# Altium schematic sheet Sensor.SchDoc
size A4; SheetNumber: 4; SheetTotal: 4
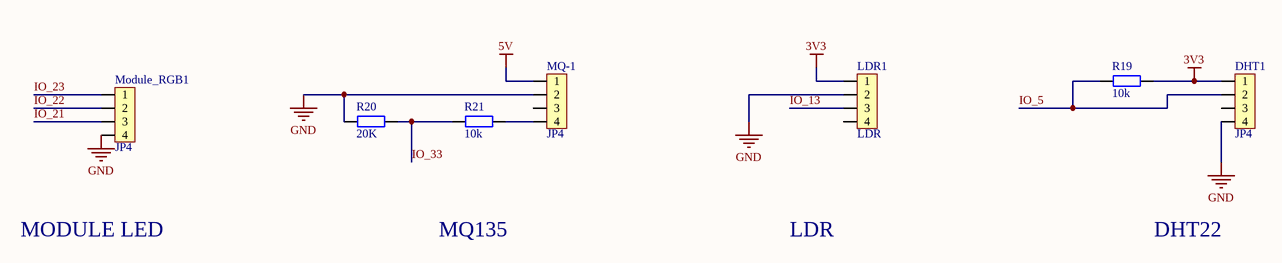
[diagram p0: Sensor.SchDoc]

## Parts
DHT1  JP4  [JP4-C1T]
LDR1  LDR  [JP4-C1T]
Module_RGB1  JP4  [JP4-C1T]
MQ-1  JP4  [JP4-C1T]
R19  10k  [RES-SMD-0805]
R20  20K  [RES-SMD-0805]
R21  10k  [RES-SMD-0805]

## Nets
3V3: DHT1.1 LDR1.1 R19.1
5V: MQ-1.1
GND: DHT1.4 LDR1.2 Module_RGB1.4 MQ-1.2 R20.1
IO_5: DHT1.2 R19.2
IO_13: LDR1.3
IO_21: Module_RGB1.3
IO_22: Module_RGB1.2
IO_23: Module_RGB1.1
IO_33: R20.2 R21.1
NetMQ-1_4: MQ-1.4 R21.2

Not connected (* = marked no-connect by the designer): DHT1 3; LDR1 4; MQ-1 3

## Notes on the sheet
- MODULE LED
- MQ135
- LDR
- DHT22

## Library data of the parts
DHT1 LDR1 MQ-1 = JP4: https://linhkien.cxt.vn/1788-header-duc-3p-xh254-3p-chan-thang-10c.html; Manufacturer: W¨¹rth Elektronik eiSos GmbH; partNo: 613004143121; ComponentLink1 Description: Manufacturer; ComponentLink2 Description: Datasheet; NoPins: 04; Created Date: 29 March 2013; ComponentLink1URL: http://www.we-online.com; ComponentLink2URL: http://katalog.we-online.de/em/datasheet/6130xx143121.pdf; Created by: Karrer Zheng
Module_RGB1 = JP4: https://linhkien.cxt.vn/1789-header-duc-254-chan-thang.html / https://shopee.vn/Module-Led-RGB-5050-i.90668226.3044531135; Manufacturer: W¨¹rth Elektronik eiSos GmbH; partNo: 613004143121; ComponentLink1 Description: Manufacturer; ComponentLink2 Description: Datasheet; NoPins: 04; Created Date: 29 March 2013; ComponentLink1URL: http://www.we-online.com; ComponentLink2URL: http://katalog.we-online.de/em/datasheet/6130xx143121.pdf; Created by: Karrer Zheng
R19 = Resistor - SMD: 1k; Manufacturer: Generic Components; Class: Passive; Published: 08/06/2000; Publisher: Altium Hobart Technology Centre
R20 R21 = Resistor - SMD: Manufacturer: Generic Components; Class: Passive; Published: 08/06/2000; Publisher: Altium Hobart Technology Centre